# Altium schematic sheet Medusa_9x8_audio.SchDoc
size Letter; SheetNumber: 2; SheetTotal: 2
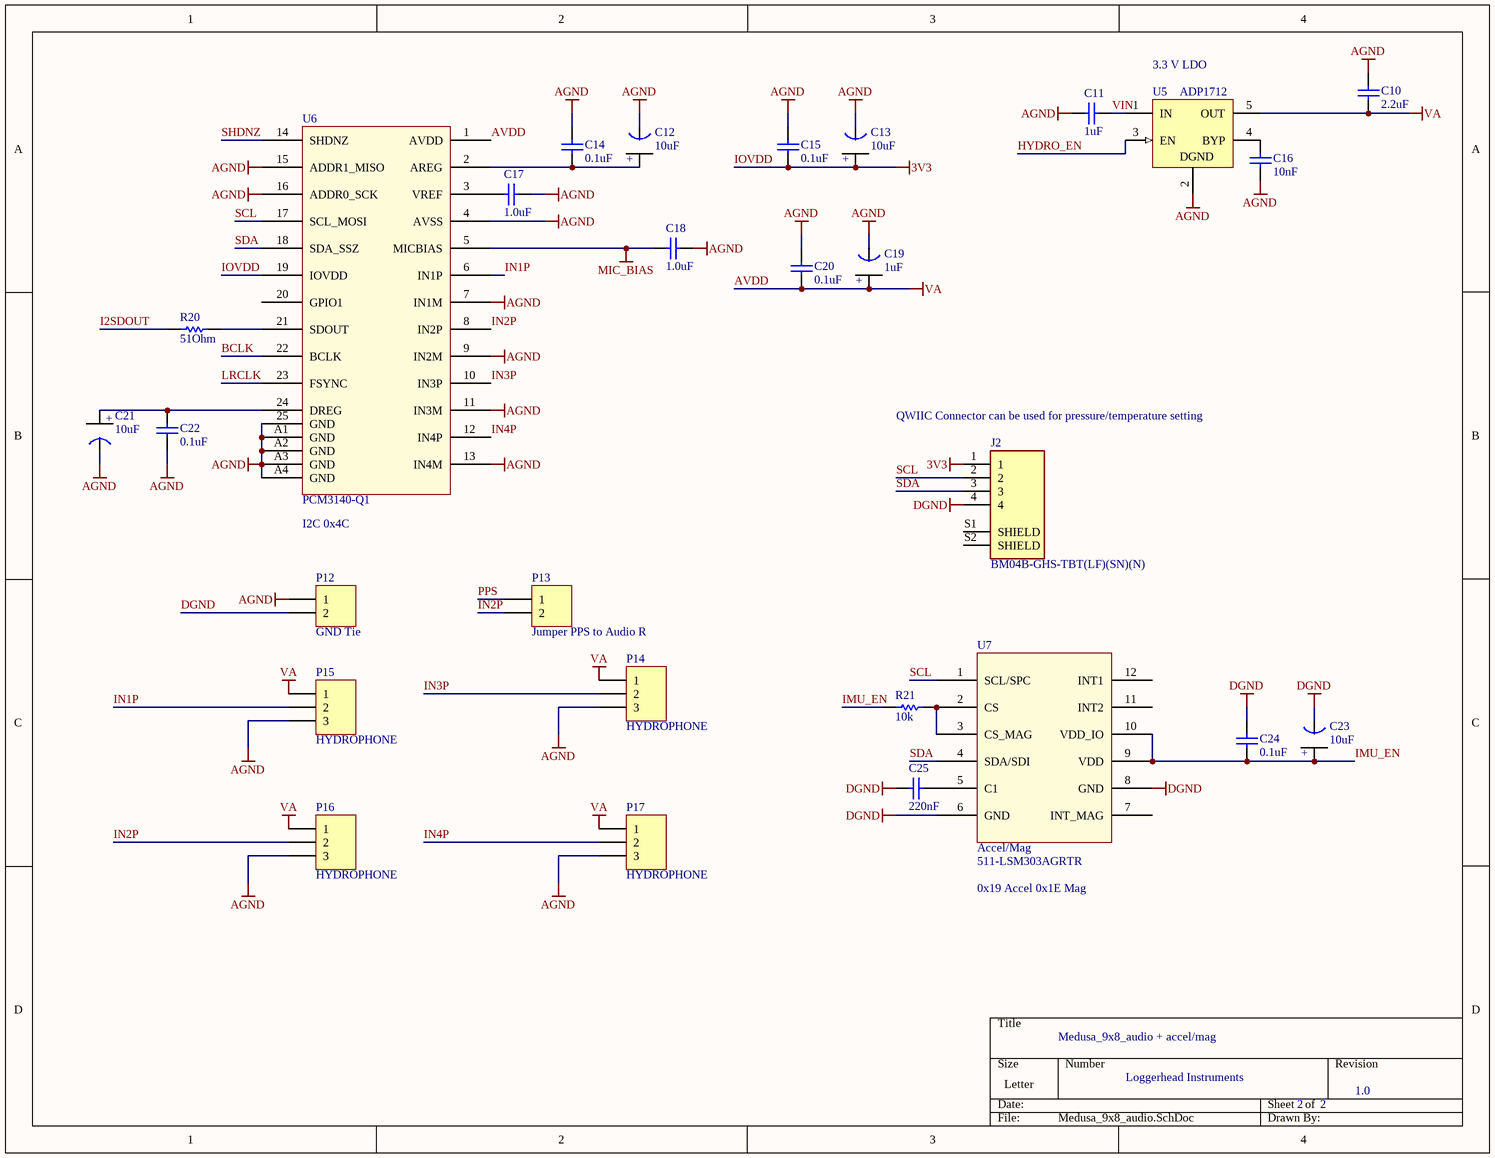
[diagram p0: Medusa_9x8_audio.SchDoc]

## Parts
C10  2.2uF  [0402]
C11  1uF  [0402]
C12  10uF  [Tant0805]
C13  10uF  [Tant0805]
C14  0.1uF  [0402]
C15  0.1uF  [0402]
C16  10nF  [0402]
C17  1.0uF  [0402]
C18  1.0uF  [0402]
C19  1uF  [Tant0805]
C20  0.1uF  [0402]
C21  10uF  [Tant0805]
C22  0.1uF  [0402]
C23  10uF  [Tant0805]
C24  0.1uF  [0402]
C25  220nF  [0402]
J2  BM04B-GHS-TBT(LF)(SN)(N)  [JST_BM04B-GHS-TBT(LF)(SN)(N)]
P12  GND Tie  [HDR1X2]
P13  Jumper PPS to Audio R  [HDR1X2]
P14  HYDROPHONE  [HDR1X3]
P15  HYDROPHONE  [HDR1X3]
P16  HYDROPHONE  [HDR1X3]
P17  HYDROPHONE  [HDR1X3]
R20  51Ohm  [2-0402]
R21  10k  [2-0402]
U5  ADP1712  [MF05A_N]
U6  PCM3140-Q1  [PCM3140]
U7  Accel/Mag  Supplier Part Number 1: 511-LSM303AGRTR  [LGA-12]

## Nets
AGND: C10.2 C11.2 C12.1(GND) C13.1(GND) C14.1 C15.1 C16.2 C17.1 C18.1 C19.1(GND) C20.1 C21.1(GND) C22.1 P12.1 P14.3 P15.3 P16.3 P17.3 U5.2(GND) U6.4(AVSS) U6.7(IN1M) U6.9(IN2M) U6.11(IN3M) U6.13(IN4M) U6.15(ADDR1_MISO) U6.16(ADDR0_SCK) U6.25(GND) U6.A1(GND) U6.A2(GND) U6.A3(GND) U6.A4(GND)
AVDD: C10.1 C19.2(+) C20.2 P14.1 P15.1 P16.1 P17.1 U5.5(OUT) U6.1(AVDD)  [also labelled VA]
DGND: C23.1(GND) C24.2 C25.1 J2.4 P12.2 U7.6(GND) U7.8(GND)
IOVDD: C13.2(+) C15.2 J2.1 U6.19(IOVDD)  [also labelled 3V3]
MIC_BIAS: C18.2 U6.5(MICBIAS)
BCLK: U6.22(BCLK)
HYDRO_EN: U5.3(EN)
I2SDOUT: R20.1
IMU_EN: C23.2(+) C24.1 R21.2 U7.9(VDD) U7.10(VDD_IO)
IN1P: P15.2 U6.6(IN1P)
IN2P: P13.2 P16.2 U6.8(IN2P)
IN3P: P14.2 U6.10(IN3P)
IN4P: P17.2 U6.12(IN4P)
LRCLK: U6.23(FSYNC)
PPS: P13.1
SCL: J2.2 U6.17(SCL_MOSI) U7.1(SCL/SPC)
SDA: J2.3 U6.18(SDA_SSZ) U7.4(SDA/SDI)
SHDNZ: U6.14(SHDNZ)
VIN: C11.1 U5.1(IN)
NetC12_2: C12.2(+) C14.2 U6.2(AREG)
NetC16_1: C16.1 U5.4(BYP)
NetC17_2: C17.2 U6.3(VREF)
NetC21_2: C21.2(+) C22.2 U6.24(DREG)
NetC25_2: C25.2 U7.5(C1)
NetR20_2: R20.2 U6.21(SDOUT)
NetR21_1: R21.1 U7.2(CS) U7.3(CS_MAG)

Not connected (* = marked no-connect by the designer): J2 S1(SHIELD) S2(SHIELD); U6 20(GPIO1); U7 7(INT_MAG) 11(INT2) 12(INT1)

## Notes on the sheet
- (near U5) 3.3 V LDO
- (near J2) QWIIC Connector can be used for pressure/temperature setting
- (near U6) I2C 0x4C
- 0x19 Accel 0x1E Mag
- Medusa_9x8_audio + accel/mag
- Loggerhead Instruments
- 2
- 1.0
- (in symbol LP3985IM5-3.3) DGND

## Library data of the parts
C10 C11 C16-C18 C25 = C0402: Ceramic Chip Capacitor - Standard; Note: Footprint corresponds to dimensions for bulk cassette packaging. This case size has tightened tolerances.; Value: 0.1uF; Published: 17-Jul-2002; LatestRevisionDate: 19-Mar-2004; LatestRevisionNote: Silkscreen size reduced.; DatasheetDocument: Mar-2001; PackageDocument: Mar-2001; PackageReference: 0402; Publisher: Altium Limited; Code_JEITA: 0402; Code_IPC: 1005 [0402]; ComponentLink1Description: Manufacturer Link; ComponentLink1URL: http://www.kemet.com/; ComponentLink2Description: Datasheet; ComponentLink2URL: http://www.kemet.com/kemet/web/homepage/kechome.nsf/vapubfilesname/F3102TA.pdf/$file/F3102TA.pdf
C12 C13 C21 C23 = Tant0805: Value: 10uF
C14 C15 C20 C22 C24 = C0402: Ceramic Chip Capacitor - Standard; Note: Footprint corresponds to dimensions for bulk cassette packaging. This case size has tightened tolerances.; Published: 17-Jul-2002; LatestRevisionDate: 19-Mar-2004; LatestRevisionNote: Silkscreen size reduced.; DatasheetDocument: Mar-2001; PackageDocument: Mar-2001; PackageReference: 0402; Publisher: Altium Limited; Code_JEITA: 0402; Code_IPC: 1005 [0402]; ComponentLink1Description: Manufacturer Link; ComponentLink1URL: http://www.kemet.com/; ComponentLink2Description: Datasheet; ComponentLink2URL: http://www.kemet.com/kemet/web/homepage/kechome.nsf/vapubfilesname/F3102TA.pdf/$file/F3102TA.pdf; Value: 0.1uF
C19 = Tant0805: Value: 10uF
J2 = BM04B-GHS-TBT(LF)(SN)(N): Connector Header Surface Mount 4 position 0.049 _1.25mm_; MF: JST Sales; MP: BM04B-GHS-TBT_LF__SN__N_; SnapEDA_Link: https://www.snapeda.com/parts/BM04B-GHS-TBT%28LF%29%28SN%29%28N%29/JST%20Sales%20America%20Inc./view-part/841999/?ref=snap; Digi-Key_Part_Number: 455-1580-1-ND; Digi-Key_Purchase_URL: https://www.digikey.com/product-detail/en/jst-sales-america-inc/BM04B-GHS-TBT_LF__SN__N_/455-1580-1-ND/807848?utm_source=snapeda&utm_medium=aggregator&utm_campaign=symbol; Value: *; Package: None
P12 P13 = Header 2: Header, 2-Pin; LatestRevisionDate: 17-Jul-2002; LatestRevisionNote: Re-released for DXP Platform.; Publisher: Altium Limited
P14-P17 = Header 3: Header, 3-Pin; LatestRevisionDate: 17-Jul-2002; LatestRevisionNote: Re-released for DXP Platform.; Publisher: Altium Limited
R20 R21 = ERJ2RB: Precision Thick Film Chip Resistor, 10 Ohm to 1M Ohm Range, 1% and 0.5% Tolerance, 0402 Size, 0.063 W; Published: 17-Dec-2003; LatestRevisionDate: 19-Mar-2004; LatestRevisionNote: Silkscreen size reduced.; PackageDocument: Mar-2003; PackageReference: 2-0402; Publisher: Altium Limited; Code_IPC: 1005 [0402]; ComponentLink1Description: Manufacturer Link; ComponentLink1URL: http://www.panasonic.com/industrial/components/resistive_products.htm; ComponentLink2Description: Datasheet; ComponentLink2URL: http://www.panasonic.com/industrial/components/pdf/AOA0000CE2.pdf
U5 = LP3985IM5-3.3: Micropower, 150mA Low-Noise Ultra Low-Dropout CMOS Voltage Regulator; Manufacturer: National Semiconductor; CompType: LDO IC; PackageTopMarking: LDQB*XTT; PowerWise: N; Published: 4-Dec-2008; DatasheetVersion: Aug-2005; PackageVersion: revD, Aug-2008; PackageReference: MF05A; Publisher: Altium Limited; PackageDescription: Molded SOT-23, .115 x .063 x .040 in Body, 5 Lead, .0375 in Pitch; PartNumber: LP3985IM5-3.3; RoHS: O; PinCount: 5; DigiKeyPartNumber: LP3985IM5-3.3CT-ND; ComponentLink1Description: LP3985 Datasheet; ComponentLink1URL: http://www.national.com/ds/LP/LP3985.pdf; ComponentLink2Description: LP3985 Web Page; ComponentLink2URL: http://www.national.com/pf/LP/LP3985.html; ComponentLink3Description: MF05A Package Page; ComponentLink3URL: http://www.national.com/packaging/folders/mf05a.html
U7 = LSM303AGR: Supplier 1: Mouser